# Altium project LUNA.PrjPcb
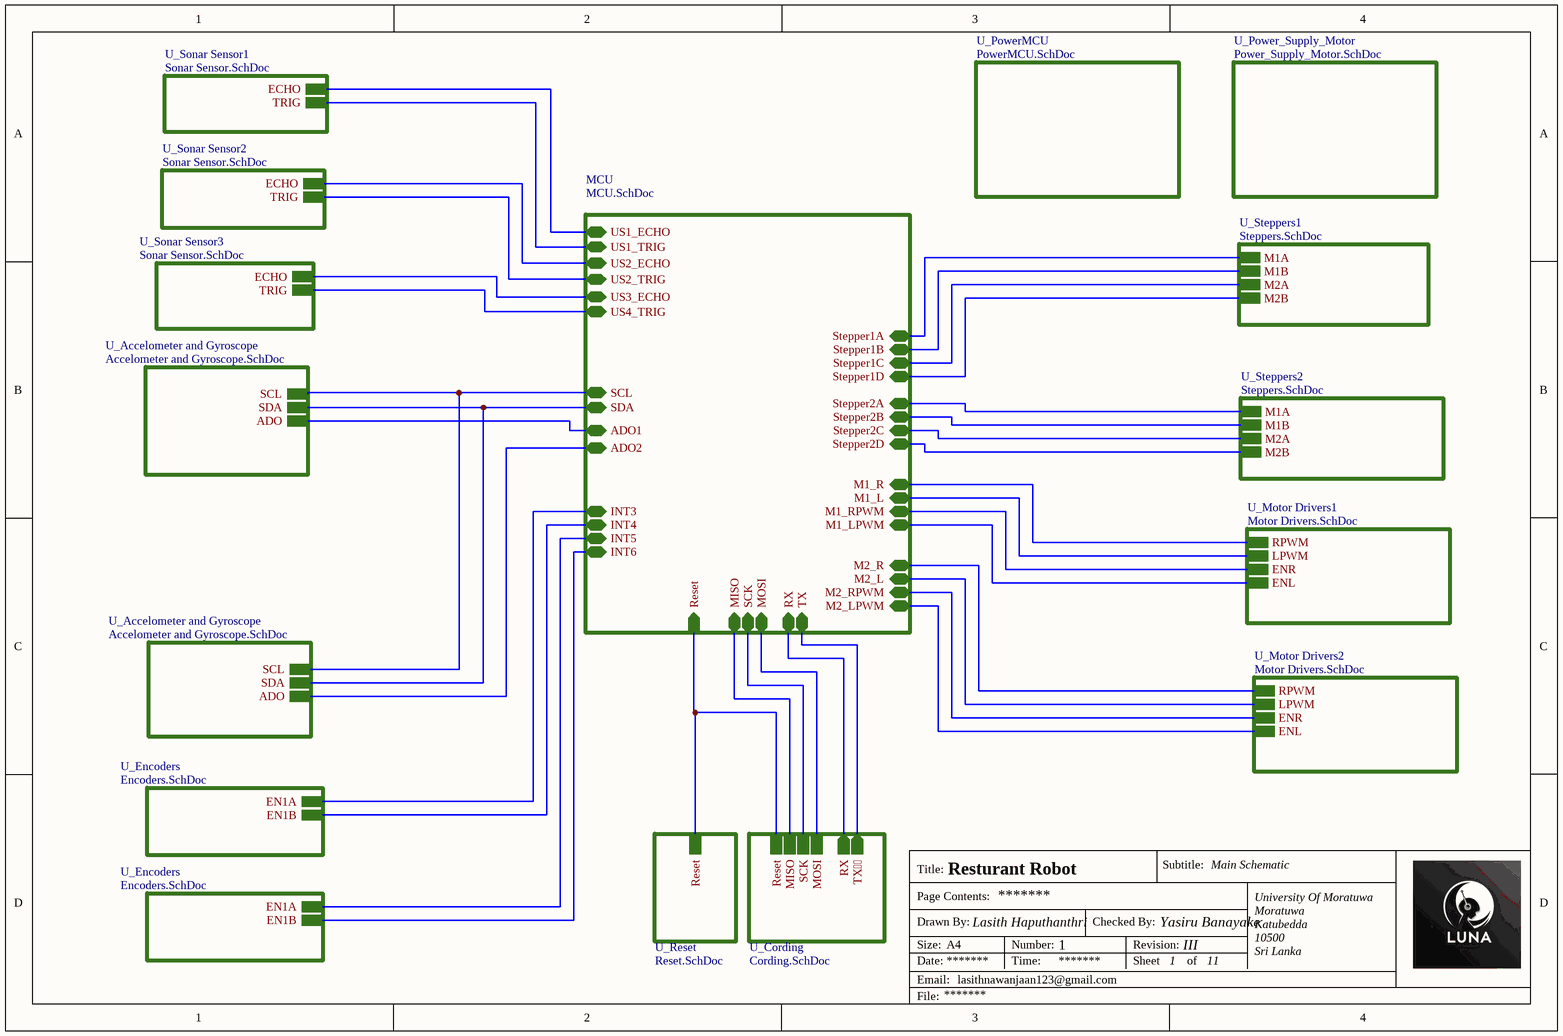
[diagram p0: Main_Schematic.SchDoc]
11 sheets, 53 parts. Net scope: hierarchical (ports join the sheet entries above them; power ports are global).
Board file: PCB.PcbDoc
Sheets:
  Main_Schematic.SchDoc
    MCU = MCU.SchDoc
    U_Reset = Reset.SchDoc
    U_Accelometer and Gyroscope = Accelometer and Gyroscope.SchDoc
    U_Accelometer and Gyroscope = Accelometer and Gyroscope.SchDoc
    U_Encoders = Encoders.SchDoc
    U_Steppers1 = Steppers.SchDoc
    U_Steppers2 = Steppers.SchDoc
    U_Motor Drivers1 = Motor Drivers.SchDoc
    U_Motor Drivers2 = Motor Drivers.SchDoc
    U_Encoders = Encoders.SchDoc
    U_Cording = Cording.SchDoc
    U_Sonar Sensor1 = Sonar Sensor.SchDoc
    U_Sonar Sensor2 = Sonar Sensor.SchDoc
    U_Sonar Sensor3 = Sonar Sensor.SchDoc
    U_PowerMCU = PowerMCU.SchDoc
    U_Power_Supply_Motor = Power_Supply_Motor.SchDoc

## Sheet Main_Schematic.SchDoc: Title
size A4; Date: *******; ApprovedBy: *******; CheckedBy: Yasiru Banayake; Author: *******; CompanyName: *******; DrawnBy: Lasith Haputhanthri; Engineer: *******; Organization: *******; Address1: *******; Address2: *******; Address3: *******; Address4: *******; DocumentNumber: 1; Revision: *******; SheetNumber: 1; SheetTotal: 11; Subtitle: Main Schematic; Project: Resturant Robot; VersionRevision: III; TotalSheet: 11; CurrentTime: *******; CurrentDate: *******; Time: *******; DocumentFullPathAndName: *******; DocumentName: *******; ModifiedDate: *******; ImagePath: *******; ProjectName: *******; Application_BuildNumber: *******

### Sub-sheets
MCU = MCU.SchDoc: Reset (in), INT3 (bidir), INT4 (bidir), INT5 (bidir), INT6 (bidir), SCL (bidir), SDA (bidir), M1_RPWM (bidir), M1_LPWM (bidir), M2_RPWM (bidir), M2_LPWM (bidir), ADO1 (bidir), ADO2 (bidir), M1_R (bidir), M1_L (bidir), M2_R (bidir), M2_L (bidir), Stepper1A (bidir), Stepper1B (bidir), Stepper1C (bidir), Stepper1D (bidir), Stepper2C (bidir), Stepper2A (bidir), Stepper2B (bidir), Stepper2D (bidir), TX (bidir), RX (bidir), SCK (bidir), MOSI (bidir), MISO (bidir), US1_ECHO (bidir), US1_TRIG (bidir), US2_ECHO (bidir), US2_TRIG (bidir), US3_ECHO (bidir), US4_TRIG (bidir)
U_Accelometer and Gyroscope = Accelometer and Gyroscope.SchDoc: SCL, SDA, ADO
U_Accelometer and Gyroscope = Accelometer and Gyroscope.SchDoc: SCL, SDA, ADO
U_Cording = Cording.SchDoc: MOSI, Reset, SCK, MISO, RX (out), TX (out)
U_Encoders = Encoders.SchDoc: EN1A, EN1B
U_Encoders = Encoders.SchDoc: EN1A, EN1B
U_Motor Drivers1 = Motor Drivers.SchDoc: RPWM, LPWM, ENR, ENL
U_Motor Drivers2 = Motor Drivers.SchDoc: RPWM, LPWM, ENR, ENL
U_Power_Supply_Motor = Power_Supply_Motor.SchDoc: no entries
U_PowerMCU = PowerMCU.SchDoc: no entries
U_Reset = Reset.SchDoc: Reset
U_Sonar Sensor1 = Sonar Sensor.SchDoc: ECHO, TRIG
U_Sonar Sensor2 = Sonar Sensor.SchDoc: ECHO, TRIG
U_Sonar Sensor3 = Sonar Sensor.SchDoc: ECHO, TRIG
U_Steppers1 = Steppers.SchDoc: M1A, M1B, M2A, M2B
U_Steppers2 = Steppers.SchDoc: M1A, M1B, M2A, M2B

### Nets
0P: sheet MCU/TX, sheet U_Cording/TX
1P: sheet MCU/RX, sheet U_Cording/RX
2P: sheet MCU/INT3, sheet U_Encoders/EN1A
3P: sheet MCU/INT4, sheet U_Encoders/EN1B
4P: sheet MCU/Stepper2D, sheet U_Steppers2/M2B
6P: sheet MCU/M1_RPWM, sheet U_Motor Drivers1/ENR
7P: sheet MCU/M1_LPWM, sheet U_Motor Drivers1/ENL
8P: sheet MCU/M2_RPWM, sheet U_Motor Drivers2/ENR
9P: sheet MCU/M2_LPWM, sheet U_Motor Drivers2/ENL
10P: sheet MCU/Stepper1A, sheet U_Steppers1/M1A
11P: sheet MCU/Stepper1B, sheet U_Steppers1/M1B
12P: sheet MCU/Stepper1C, sheet U_Steppers1/M2A
13P: sheet MCU/Stepper1D, sheet U_Steppers1/M2B
18P: sheet MCU/INT6, sheet U_Encoders/EN1B
19P: sheet MCU/INT5, sheet U_Encoders/EN1A
20P: sheet MCU/SDA, sheet U_Accelometer and Gyroscope/SDA, sheet U_Accelometer and Gyroscope/SDA
21P: sheet MCU/SCL, sheet U_Accelometer and Gyroscope/SCL, sheet U_Accelometer and Gyroscope/SCL
22P: sheet MCU/ADO1, sheet U_Accelometer and Gyroscope/ADO
23P: sheet MCU/ADO2, sheet U_Accelometer and Gyroscope/ADO
24P: sheet MCU/M1_R, sheet U_Motor Drivers1/RPWM
25P: sheet MCU/M1_L, sheet U_Motor Drivers1/LPWM
26P: sheet MCU/M2_R, sheet U_Motor Drivers2/RPWM
44P: sheet MCU/Stepper2C, sheet U_Steppers2/M2A
45P: sheet MCU/Stepper2B, sheet U_Steppers2/M1B
46P: sheet MCU/Stepper2A, sheet U_Steppers2/M1A
50P: sheet MCU/MISO, sheet U_Cording/MISO
51P: sheet MCU/MOSI, sheet U_Cording/MOSI
52P: sheet MCU/SCK, sheet U_Cording/SCK
A0: sheet MCU/US1_ECHO, sheet U_Sonar Sensor1/ECHO
A1: sheet MCU/US1_TRIG, sheet U_Sonar Sensor1/TRIG
A2: sheet MCU/US2_ECHO, sheet U_Sonar Sensor2/ECHO
A3: sheet MCU/US2_TRIG, sheet U_Sonar Sensor2/TRIG
A4: sheet MCU/US3_ECHO, sheet U_Sonar Sensor3/ECHO
A5: sheet MCU/US4_TRIG, sheet U_Sonar Sensor3/TRIG
LPWM: sheet MCU/M2_L, sheet U_Motor Drivers2/LPWM
Reset: sheet MCU/Reset, sheet U_Reset/Reset, sheet U_Cording/Reset

### Notes on the sheet
- Title:
- Drawn By:
- Page Contents:
- Checked By:
- Subtitle:
- University Of Moratuwa
- Moratuwa
- Size:
- Date:
- File:
- Email:
- A4
- lasithnawanjaan123@gmail.com
- Lasith Haputhanthri
- Number:
- Time:
- Revision:
- Sheet
- of
- Katubedda
- 10500
- Sri Lanka

## Sheet MCU.SchDoc: Title
size A4; Date: *******; ApprovedBy: *******; CheckedBy: Yasiru Banayake; Author: *******; CompanyName: *******; DrawnBy: Name; Engineer: *******; Organization: *******; Address1: *******; Address2: *******; Address3: *******; Address4: *******; DocumentNumber: Doc Num; Revision: *******; SheetNumber: 11; SheetTotal: 11; Subtitle: MCU; Project: Resturant Robot; VersionRevision: III; TotalSheet: 11; CurrentTime: *******; CurrentDate: *******; Time: *******; DocumentFullPathAndName: *******; DocumentName: *******; ModifiedDate: *******; ImagePath: *******; ProjectName: *******; Application_BuildNumber: *******
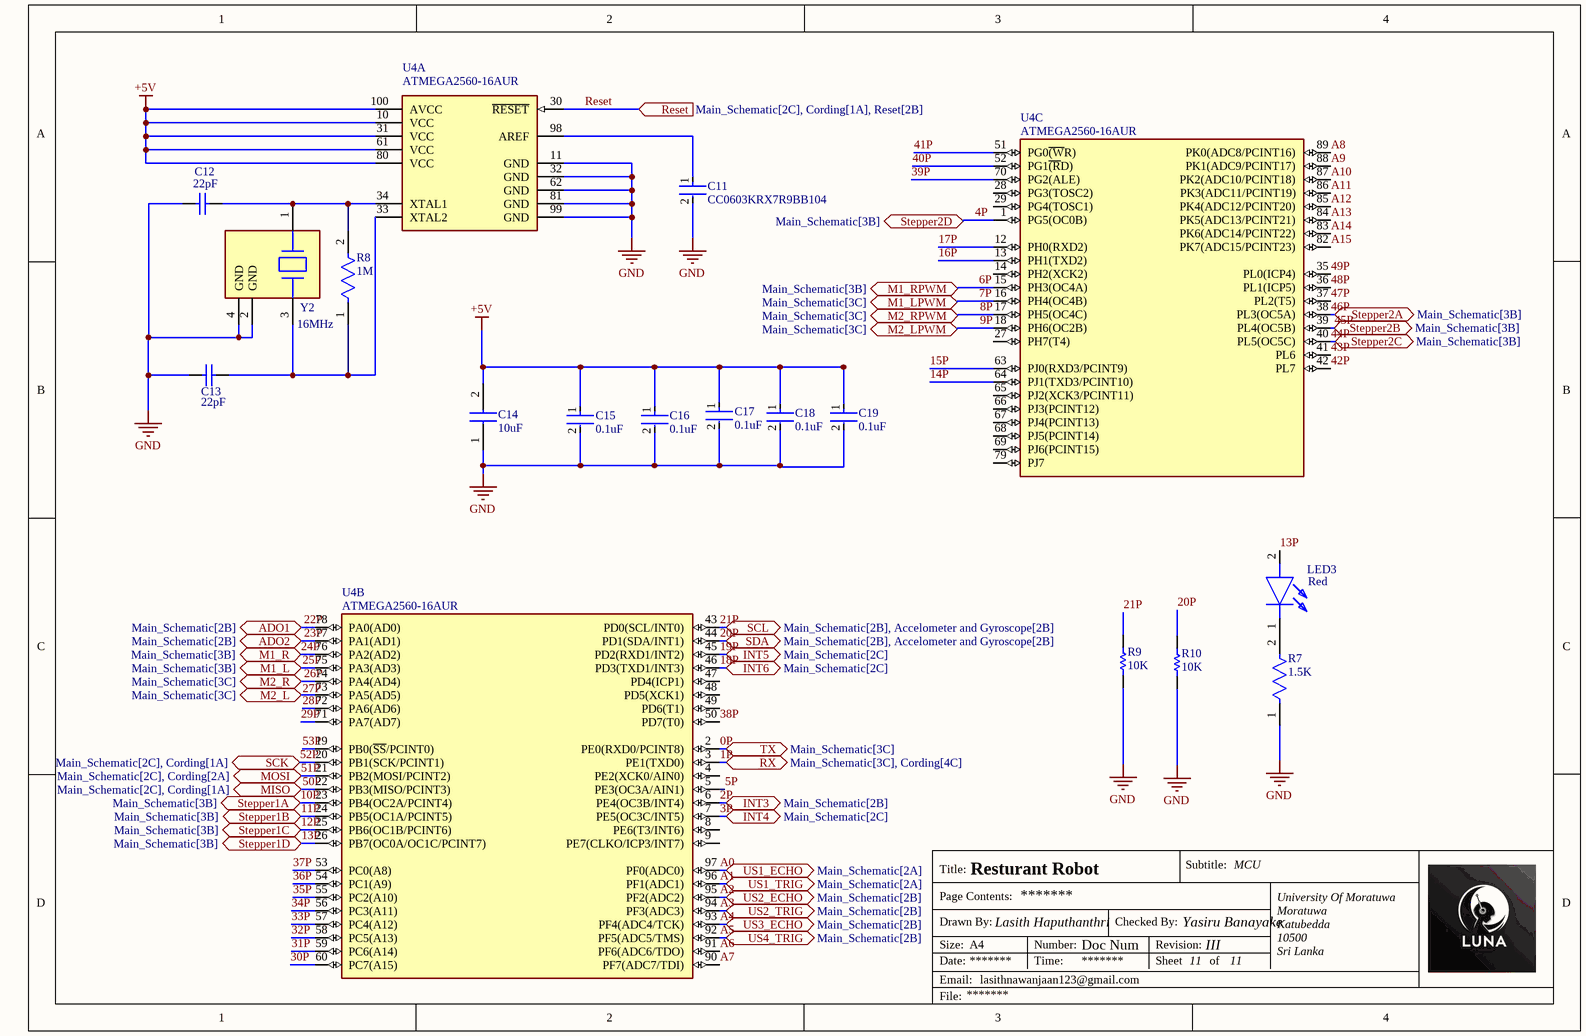
[diagram p1: MCU.SchDoc]

### Parts
C11  CC0603KRX7R9BB104  [FP-CC0603-DA-MFG]
C12  22pF  [CAPC1608X90X40LL10T20]
C13  22pF  [CAPC1608X90X40LL10T20]
C14  10uF  [CAPC1608X90N]
C15  0.1uF  [FP-CC0603-DA-MFG]
C16  0.1uF  [FP-CC0603-DA-MFG]
C17  0.1uF  [FP-CC0603-DA-MFG]
C18  0.1uF  [FP-CC0603-DA-MFG]
C19  0.1uF  [FP-CC0603-DA-MFG]
LED3  Red  [LEDC1608X55N]
R7  1.5K  [FP-AF0603-IPC_B]
R8  1M  [FP-AF0603-IPC_B]
R9  10K  [RESC1608X55X25ML10T15]
R10  10K  [RESC1608X55X25ML10T15]
U4  ATMEGA2560-16AUR  [FP-100A-MFG]  (parts A,B,C of 3)
Y2  16MHz  [FP-ABM8G-MFG]

### Ports
ADO1 (bidir, see Main_Schematic[2B]), ADO2 (bidir, see Main_Schematic[2B]), INT3 (bidir, see Main_Schematic[2B]), INT4 (bidir, see Main_Schematic[2C]), INT5 (bidir, see Main_Schematic[2C]), INT6 (bidir, see Main_Schematic[2C]), M1_L (bidir, see Main_Schematic[3B]), M1_LPWM (bidir, see Main_Schematic[3C]), M1_R (bidir, see Main_Schematic[3B]), M1_RPWM (bidir, see Main_Schematic[3B]), M2_L (bidir, see Main_Schematic[3C]), M2_LPWM (bidir, see Main_Schematic[3C]), M2_R (bidir, see Main_Schematic[3C]), M2_RPWM (bidir, see Main_Schematic[3C]), MISO (bidir, see Main_Schematic[2C], Cording[1A]), MOSI (bidir, see Main_Schematic[2C], Cording[2A]), Reset (in, see Main_Schematic[2C], Cording[1A], Reset[2B]), RX (bidir, see Main_Schematic[3C], Cording[4C]), SCK (bidir, see Main_Schematic[2C], Cording[1A]), SCL (bidir, see Main_Schematic[2B], Accelometer and Gyroscope[2B]), SDA (bidir, see Main_Schematic[2B], Accelometer and Gyroscope[2B]), Stepper1A (bidir, see Main_Schematic[3B]), Stepper1B (bidir, see Main_Schematic[3B]), Stepper1C (bidir, see Main_Schematic[3B]), Stepper1D (bidir, see Main_Schematic[3B]), Stepper2A (bidir, see Main_Schematic[3B]), Stepper2B (bidir, see Main_Schematic[3B]), Stepper2C (bidir, see Main_Schematic[3B]), Stepper2D (bidir, see Main_Schematic[3B]), TX (bidir, see Main_Schematic[3C]), US1_ECHO (bidir, see Main_Schematic[2A]), US1_TRIG (bidir, see Main_Schematic[2A]), US2_ECHO (bidir, see Main_Schematic[2B]), US2_TRIG (bidir, see Main_Schematic[2B]), US3_ECHO (bidir, see Main_Schematic[2B]), US4_TRIG (bidir, see Main_Schematic[2B])

### Nets
+5V: C14.2 C15.1 C16.1 C17.1 C18.1 C19.1 U4.10(VCC) U4.31(VCC) U4.61(VCC) U4.80(VCC) U4.100(AVCC)
GND: C11.2 C12.1 C13.1 C14.1 C15.2 C16.2 C17.2 C18.2 C19.2 R7.1 R9.1 R10.1 U4.11(GND) U4.32(GND) U4.62(GND) U4.81(GND) U4.99(GND) Y2.2(GND) Y2.4(GND)
0P: U4.2(PE0(RXD0/PCINT8)) ; port TX
1P: U4.3(PE1(TXD0)) ; port RX
2P: U4.6(PE4(OC3B/INT4)) ; port INT3
3P: U4.7(PE5(OC3C/INT5)) ; port INT4
4P: U4.1(PG5(OC0B)) ; port Stepper2D
5P: U4.5(PE3(OC3A/AIN1))
6P: U4.15(PH3(OC4A)) ; port M1_RPWM
7P: U4.16(PH4(OC4B)) ; port M1_LPWM
8P: U4.17(PH5(OC4C)) ; port M2_RPWM
9P: U4.18(PH6(OC2B)) ; port M2_LPWM
10P: U4.23(PB4(OC2A/PCINT4)) ; port Stepper1A
11P: U4.24(PB5(OC1A/PCINT5)) ; port Stepper1B
12P: U4.25(PB6(OC1B/PCINT6)) ; port Stepper1C
13P: LED3.2(A) U4.26(PB7(OC0A/OC1C/PCINT7)) ; port Stepper1D
14P: U4.64(PJ1(TXD3/PCINT10))
15P: U4.63(PJ0(RXD3/PCINT9))
16P: U4.13(PH1(TXD2))
17P: U4.12(PH0(RXD2))
18P: U4.46(PD3(TXD1/INT3)) ; port INT6
19P: U4.45(PD2(RXD1/INT2)) ; port INT5
20P: R10.2 U4.44(PD1(SDA/INT1)) ; port SDA
21P: R9.2 U4.43(PD0(SCL/INT0)) ; port SCL
22P: U4.78(PA0(AD0)) ; port ADO1
23P: U4.77(PA1(AD1)) ; port ADO2
24P: U4.76(PA2(AD2)) ; port M1_R
25P: U4.75(PA3(AD3)) ; port M1_L
26P: U4.74(PA4(AD4)) ; port M2_R
28P: U4.72(PA6(AD6))
29P: U4.71(PA7(AD7))
30P: U4.60(PC7(A15))
31P: U4.59(PC6(A14))
32P: U4.58(PC5(A13))
33P: U4.57(PC4(A12))
34P: U4.56(PC3(A11))
35P: U4.55(PC2(A10))
36P: U4.54(PC1(A9))
37P: U4.53(PC0(A8))
38P: U4.50(PD7(T0))
39P: U4.70(PG2(ALE))
40P: U4.52(PG1~{(R}D))
41P: U4.51(PG0~{(W}R))
42P: U4.42(PL7)
43P: U4.41(PL6)
44P: U4.40(PL5(OC5C)) ; port Stepper2C
45P: U4.39(PL4(OC5B)) ; port Stepper2B
46P: U4.38(PL3(OC5A)) ; port Stepper2A
47P: U4.37(PL2(T5))
48P: U4.36(PL1(ICP5))
49P: U4.35(PL0(ICP4))
50P: U4.22(PB3(MISO/PCINT3)) ; port MISO
51P: U4.21(PB2(MOSI/PCINT2)) ; port MOSI
52P: U4.20(PB1(SCK/PCINT1)) ; port SCK
53P: U4.19(PB0(~{SS}/PCINT0))
A0: U4.97(PF0(ADC0)) ; port US1_ECHO
A1: U4.96(PF1(ADC1)) ; port US1_TRIG
A2: U4.95(PF2(ADC2)) ; port US2_ECHO
A3: U4.94(PF3(ADC3)) ; port US2_TRIG
A4: U4.93(PF4(ADC4/TCK)) ; port US3_ECHO
A5: U4.92(PF5(ADC5/TMS)) ; port US4_TRIG
A6: U4.91(PF6(ADC6/TDO))
A7: U4.90(PF7(ADC7/TDI))
A8: U4.89(PK0(ADC8/PCINT16))
A9: U4.88(PK1(ADC9/PCINT17))
A10: U4.87(PK2(ADC10/PCINT18))
A11: U4.86(PK3(ADC11/PCINT19))
A12: U4.85(PK4(ADC12/PCINT20))
A13: U4.84(PK5(ADC13/PCINT21))
A14: U4.83(PK6(ADC14/PCINT22))
A15: U4.82(PK7(ADC15/PCINT23))
LPWM: U4.73(PA5(AD5)) ; port M2_L
Reset: U4.30(~{RESET}) ; port Reset
NetC11_1: C11.1 U4.98(AREF)
NetC12_2: C12.2 R8.2 U4.34(XTAL1) Y2.1
NetC13_2: C13.2 R8.1 U4.33(XTAL2) Y2.3
NetLED3_1: LED3.1(K) R7.2

Not connected (* = marked no-connect by the designer): U4 4(PE2(XCK0/AIN0)) 8(PE6(T3/INT6)) 9(PE7(CLKO/ICP3/INT7)) 14(PH2(XCK2)) 27(PH7(T4)) 28(PG3(TOSC2)) 29(PG4(TOSC1)) 47(PD4(ICP1)) 48(PD5(XCK1)) 49(PD6(T1)) 65(PJ2(XCK3/PCINT11)) 66(PJ3(PCINT12)) 67(PJ4(PCINT13)) 68(PJ5(PCINT14)) 69(PJ6(PCINT15)) 79(PJ7)

### Notes on the sheet
- Labels drawn without touching a wire or pin: 27P
- Title:
- Drawn By:
- Page Contents:
- Checked By:
- Subtitle:
- University Of Moratuwa
- Moratuwa
- Size:
- Date:
- File:
- Email:
- A4
- lasithnawanjaan123@gmail.com
- Lasith Haputhanthri
- Number:
- Time:
- Revision:
- Sheet
- of
- Katubedda
- 10500
- Sri Lanka

### Library data of the parts
C11 = CMP-2100-03601-2: CAP CER 0.1UF 50V X7R 0603; Manufacturer: YAGEO; Material: Ceramic; Capacitance: 100 nF; Temperature Coefficient: 15%; Tolerance: 0.1; Value: 100 nF; Height: 0.9mm; Voltage: 50 V; ComponentLink2Description: Datasheet; Device Class L2: Capacitors; Temperature Range High: +125°C; Category: Cap; Footprint Url: http://www.yageo.com/exep/pages/download/literatures/UPY-C_GEN_24.pdf; ComponentLink2URL: http://www.yageo.com/documents/recent/UPY-GPHC_X7R_6.3V-to-50V_18.pdf; Package: CC0603-DA; Temperature: -55°C to +125°C; Voltage Rating: 50 V; Temperature Characteristic: X7R; Device Class L1: Passive Components; Temperature Range Low: -55°C; Manufacturer Part Number: CC0603KRX7R9BB104; RoHS: TRUE; Automotive: No; Device Class L3: Ceramic Capacitors; Octopart: https://octopart.com/cc0603krx7r9bb104-yageo-42244635; Mouser Description: Multilayer Ceramic Capacitor, CC Series, 0.1 - F, - 10%, X7R, 50 V, 0603 [1608 Metric]; Lead Free: Yes; Digikey Description: CAP CER 0.1UF 50V X7R 0603
C12 C13 = CMP-1659-00026-1: CC0603JRNPO9BN220 Chip Capacitor, 22 pF, +/- 5%, 50 V, -55 to 125 degC, 0603 (1608 Metric), RoHS, Tape and Reel; ComponentLink1URL: http://www.yageo.com/; PackageReference: 0603; ComponentLink1Description: Manufacturer URL; PackageDescription: 2-Pin Surface Mount Device, Body 1.6 x 0.8 mm; DatasheetVersion: Rev. 8, 08/2011; ComponentLink2Description: Datasheet; ComponentLink2URL: http://www.yageo.com/documents/recent/UPY-GP_NP0_16V-to-50V_8.pdf
C14 = CL10A106KP8NNNC: CL10A106KP8NNNC Capacitor; Manufacturer_Name: SAMSUNG; Datasheet Link: https://datasheet.datasheetarchive.com/originals/distributors/Datasheets-DGA10/2415998.pdf; Height: 0.9mm; Manufacturer_Part_Number: CL10A106KP8NNNC; Mouser Part Number: 187-CL10A106KP8NNNC; Mouser Price/Stock: https://www.mouser.co.uk/ProductDetail/Samsung-Electro-Mechanics/CL10A106KP8NNNC?qs=X6jEic%2FHinAlyfRHj7fKwg%3D%3D; Arrow Part Number: CL10A106KP8NNNC; Arrow Price/Stock: https://www.arrow.com/en/products/cl10a106kp8nnnc/samsung-electro-mechanics?region=europe
C15-C19 = CMP-2100-03601-2: CC0603KRX7R9BB104 CAP CER 0.1UF 50V X7R 0603; Manufacturer: YAGEO; Material: Ceramic; Capacitance: 100 nF; Temperature Coefficient: 15%; Tolerance: 0.1; Value: 100 nF; Height: 0.9mm; Voltage: 50 V; ComponentLink2Description: Datasheet; Device Class L2: Capacitors; Temperature Range High: +125°C; Category: Cap; Footprint Url: http://www.yageo.com/exep/pages/download/literatures/UPY-C_GEN_24.pdf; ComponentLink2URL: http://www.yageo.com/documents/recent/UPY-GPHC_X7R_6.3V-to-50V_18.pdf; Package: CC0603-DA; Temperature: -55°C to +125°C; Voltage Rating: 50 V; Temperature Characteristic: X7R; Device Class L1: Passive Components; Temperature Range Low: -55°C; Manufacturer Part Number: CC0603KRX7R9BB104; RoHS: TRUE; Automotive: No; Device Class L3: Ceramic Capacitors; Octopart: https://octopart.com/cc0603krx7r9bb104-yageo-42244635; Mouser Description: Multilayer Ceramic Capacitor, CC Series, 0.1 - F, - 10%, X7R, 50 V, 0603 [1608 Metric]; Lead Free: Yes; Digikey Description: CAP CER 0.1UF 50V X7R 0603
LED3 = LTST-C191KRKT: LED; Manufacturer_Name: Lite-On; Datasheet Link: http://www.mouser.com/ds/2/239/S_110_LTST-C191KRKT-539838.pdf; Height: 0.55mm; Manufacturer_Part_Number: LTST-C191KRKT; Mouser Part Number: 859-LTST-C191KRKT; Mouser Price/Stock: https://www.mouser.co.uk/ProductDetail/Lite-On/LTST-C191KRKT?qs=BAIUz4Y8PJBLfOhzue0q%252BA%3D%3D; Arrow Part Number: LTST-C191KRKT; Arrow Price/Stock: https://www.arrow.com/en/products/ltst-c191krkt/lite-on-technology?region=nac
R7 R8 = CMP-03412-043191-1: AF0603FR-071K5L Anti-Sulfurated Chip Resistors Automotive Grade 1.5kΩ 1% 100ppm/°C 0603; Resistance: 1.5kR; Max Power Dissipation: 100mW; Length: 0.063inch; Packaging: Tape and Reel; Tolerance: 1%; RoHS Compliant: Yes; Series: AF; Temperature Coefficient: 100ppm/°C; Case/Package: 0603; Height: 0.022inch; Min Operating Temperature: -55°C; Resistor Type: Thick Film; Features: Moisture Resistant; Width: 0.031inch; Number of Terminations: 2; Max Operating Temperature: 155°C
R9 R10 = CMP-2000-05022-1: RC0603JR-0710KL Resistor, 10 KOhm, +/- 5%, 100 mW, -55 to 155 degC, 0603 (1608 Metric), RoHS, Tape and Reel; Manufacturer: Yageo; Resistance: 10kOhms; Voltage Rating: 50V; Temperature Coefficient: 100PPM/C; Power Rating: 100mW; Package Reference: 603; Series: RC; Case Code - mm: 1608; Packaging: Reel; Datasheet URL: http://www.farnell.com/datasheets/443971.pdf; Datasheet Version: Rev. 4, 04/2009; Operating Temperature Range: -55Cto+155C; Product: ThickFilmResistorsGeneralPurpose; Package Description: 2-Pin Surface Mount Device, Body 1.6 x 0.8 mm; Manufacturer URL: http://www.yageo.com/; Case Code - in: 0603; Tolerance: 5%; Termination Style: SMD/SMT
U4 = CMP-06276-000073-1: IC MCU 8BIT 256KB FLASH 100TQFP; Oscillator Type: External; Interface: UART; Memory Type: OTP; Memory Size: 8KB; Core Architecture: PIC; Peripherals: POR; Frequency: 16MHz; Number of I/Os: 33; Packaging: Rail/Tube; Max Operating Temperature: 70°C; Case/Package: DIP; Min Operating Temperature: 0°C
Y2 = CMP-2000-05039-3: ABM8G-16.000MHZ-18-D2Y-T Crystal 12MHz ±20ppm (Tol) ±30ppm (Stability) 18pF FUND 120Ω 4-Pin SMD T/R; Series Resistance: 120R; Max Operating Temperature: 85°C; Mount: Surface Mount; Width: 2.5mm; Series: ABM8G; Termination: SMD/SMT; Frequency Tolerance: 20ppm; Tolerance: 20ppm; Min Operating Temperature: -40°C; Operating Frequency: 12 MHz; Depth: 2.5mm; Load Capacitance: 18pF; Number of Pins: 4; Length: 3.2mm; Radiation Hardening: No; Frequency Stability: 30ppm; Height: 1mm; Packaging: Tape and Reel; Package Quantity: 1000; ESR (Equivalent Series Resistance): 120R; Lead Free: Lead Free; Frequency: 12MHz; Case/Package: CSMD

## Sheet Reset.SchDoc: Title
size A4; Date: *******; ApprovedBy: *******; CheckedBy: Yasiru Banayake; Author: *******; CompanyName: *******; DrawnBy: Name; Engineer: *******; Organization: *******; Address1: *******; Address2: *******; Address3: *******; Address4: *******; DocumentNumber: Doc Num; Revision: *******; SheetNumber: 9; SheetTotal: 11; Subtitle: MCU Reset; Project: Resturant Robot; VersionRevision: III; TotalSheet: 11; CurrentTime: *******; CurrentDate: *******; Time: *******; DocumentFullPathAndName: *******; DocumentName: *******; ModifiedDate: *******; ImagePath: *******; ProjectName: *******; Application_BuildNumber: *******
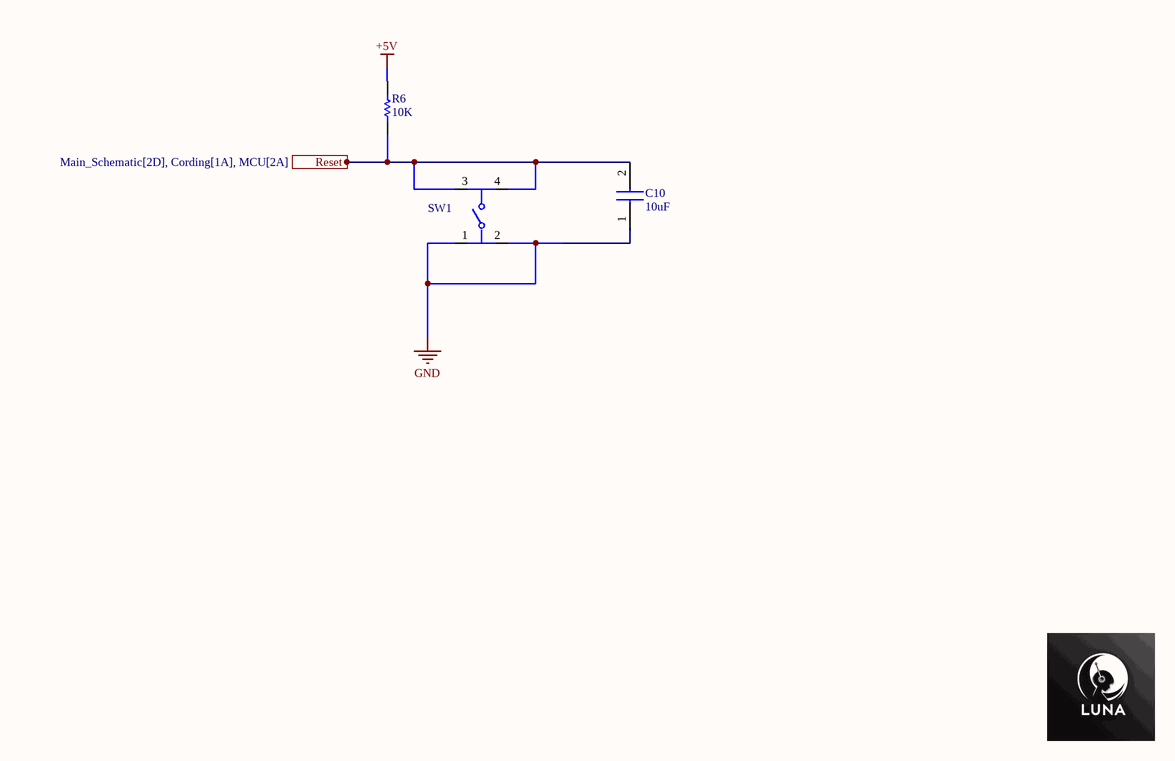
[diagram p2: Reset.SchDoc]

### Parts
C10  10uF  [CAPC1608X90N]
R6  10K  [RESC1608X55X25ML10T15]
SW1  PTS526SK15SMTR2LFS  [FP-PTS526SK15SMTR2LFS-MFG]  (value not drawn)

### Ports
Reset (see Main_Schematic[2D], Cording[1A], MCU[2A])

### Nets
+5V: R6.2
GND: C10.1 SW1.1 SW1.2
Reset: C10.2 R6.1 SW1.3 SW1.4 ; port Reset

### Notes on the sheet
- Title:
- Drawn By:
- Page Contents:
- Checked By:
- Subtitle:
- University Of Moratuwa
- Moratuwa
- Size:
- Date:
- File:
- Email:
- A4
- lasithnawanjaan123@gmail.com
- Lasith Haputhanthri
- Number:
- Time:
- Revision:
- Sheet
- of
- Katubedda
- 10500
- Sri Lanka

### Library data of the parts
C10 = CL10A106KP8NNNC: as C14 on sheet MCU; Datasheet Link: https://datasheet.datasheetarchive.com/originals/distributors/Datasheets-DGA10/2415998.pdf; Height: 0.9mm; Manufacturer_Part_Number: CL10A106KP8NNNC; Mouser Part Number: 187-CL10A106KP8NNNC; Mouser Price/Stock: https://www.mouser.co.uk/ProductDetail/Samsung-Electro-Mechanics/CL10A106KP8NNNC?qs=X6jEic%2FHinAlyfRHj7fKwg%3D%3D; Arrow Part Number: CL10A106KP8NNNC; Arrow Price/Stock: https://www.arrow.com/en/products/cl10a106kp8nnnc/samsung-electro-mechanics?region=europe
R6 = CMP-2000-05022-1: as R9 on sheet MCU; Package Reference: 603; Series: RC; Case Code - mm: 1608; Packaging: Reel; Datasheet URL: http://www.farnell.com/datasheets/443971.pdf; Datasheet Version: Rev. 4, 04/2009; Operating Temperature Range: -55Cto+155C; Product: ThickFilmResistorsGeneralPurpose; Package Description: 2-Pin Surface Mount Device, Body 1.6 x 0.8 mm; Manufacturer URL: http://www.yageo.com/; Case Code - in: 0603; Tolerance: 5%; Termination Style: SMD/SMT
SW1 = CMP-10040-000013-1: TACT 5.2 X 5.2, 1.5 MM H, 260GF,; Manufacturer: C&K; Operating Force: 250gf; Throw Configuration: SPST-NO; Contact Current Rating: 50mA; Standoff Height: 0mm; Contact Resistance: 100mΩ; Voltage Rating Dc: 12V; Electromechanical Life: 200000Cycles; Device Class L3: Tactile Switches; Device Class L2: Switches; Temperature: -20°C to +70°C; Temperature Range Low: -20°C; Package: PTS526SK15SMTR2LFS; Temperature Range High: +70°C; ComponentLink2Description: Datasheet; Device Class L1: Electromechanical; Height: 1.65mm; Digikey Description: TACT 5.2 X 5.2, 1.5 MM H, 260GF,; Category: Switch; RoHS: TRUE; Automotive: No; Lead Free: Yes; Manufacturer Part Number: PTS526SK15SMTR2LFS; Octopart: https://octopart.com/pts526+sk15+smtr2+lfs-c%26k+components-100617999; ComponentLink2URL: https://www.ckswitches.com/media/2780/pts526.pdf

## Sheet Accelometer and Gyroscope.SchDoc: Title
size A4; Date: *******; ApprovedBy: *******; CheckedBy: Yasiru Banayake; Author: *******; CompanyName: *******; DrawnBy: Name; Engineer: *******; Organization: *******; Address1: *******; Address2: *******; Address3: *******; Address4: *******; DocumentNumber: Doc Num; Revision: *******; SheetNumber: 2; SheetTotal: 11; Subtitle: Accelometer JST; Project: Resturant Robot; VersionRevision: III; TotalSheet: 11; CurrentTime: *******; CurrentDate: *******; Time: *******; DocumentFullPathAndName: *******; DocumentName: *******; ModifiedDate: *******; ImagePath: *******; ProjectName: *******; Application_BuildNumber: *******
Used 2 times, as channels U_Accelometer and Gyroscope, U_Accelometer and Gyroscope. Parts and nets are listed once, with the designators drawn on the sheet.
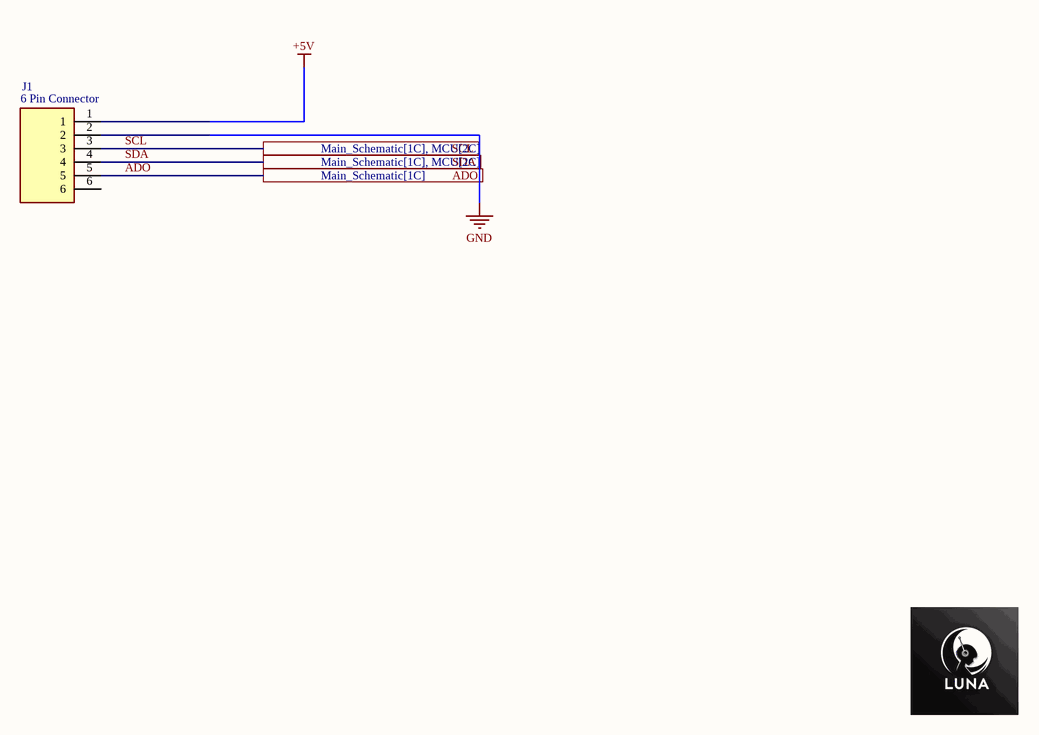
[diagram p3: Accelometer and Gyroscope.SchDoc]

### Parts
J1  6 Pin Connector  [SHDR6W64P0X250_1X6_1740X575X700P]

### Ports
ADO (see Main_Schematic[1C]), SCL (see Main_Schematic[1C], MCU[2C]), SDA (see Main_Schematic[1C], MCU[2C])

### Nets
+5V: J1.1
GND: J1.2
ADO: J1.5 ; port ADO
SCL: J1.3 ; port SCL
SDA: J1.4 ; port SDA

Not connected (* = marked no-connect by the designer): J1 6

### Channels
U_Accelometer and Gyroscope: designators end in _U_Accelometer_and_Gyroscope#1; ports ADO=22P SCL=21P SDA=20P
U_Accelometer and Gyroscope: designators end in _U_Accelometer_and_Gyroscope#2; ports ADO=23P SCL=21P SDA=20P

### Notes on the sheet
- Title:
- Drawn By:
- Page Contents:
- Checked By:
- Subtitle:
- University Of Moratuwa
- Moratuwa
- Size:
- Date:
- File:
- Email:
- A4
- lasithnawanjaan123@gmail.com
- Lasith Haputhanthri
- Number:
- Time:
- Revision:
- Sheet
- of
- Katubedda
- 10500
- Sri Lanka

### Library data of the parts
J1 = B6B-XH-A_LF__SN_: B6B-XH-A_LF__SN_ Connector; Manufacturer_Name: JST (JAPAN SOLDERLESS TERMINALS); Manufacturer_Part_Number: B6B-XH-A(LF)(SN); Datasheet Link: https://datasheet.lcsc.com/szlcsc/JST-Sales-America-B6B-XH-A-LF-SN_C144397.pdf; Height: 7mm; Arrow Part Number: B6B-XH-A(LF)(SN); Arrow Price/Stock: https://www.arrow.com/en/products/b6b-xh-a-lf-sn/jst-manufacturing?region=europe

## Sheet Encoders.SchDoc: Title
size A4; Date: *******; ApprovedBy: *******; CheckedBy: Yasiru Banayake; Author: *******; CompanyName: *******; DrawnBy: Name; Engineer: *******; Organization: *******; Address1: *******; Address2: *******; Address3: *******; Address4: *******; DocumentNumber: Doc Num; Revision: *******; SheetNumber: 4; SheetTotal: 11; Subtitle: Encoder JST; Project: Resturant Robot; VersionRevision: III; TotalSheet: 11; CurrentTime: *******; CurrentDate: *******; Time: *******; DocumentFullPathAndName: *******; DocumentName: *******; ModifiedDate: *******; ImagePath: *******; ProjectName: *******; Application_BuildNumber: *******
Used 2 times, as channels U_Encoders, U_Encoders. Parts and nets are listed once, with the designators drawn on the sheet.
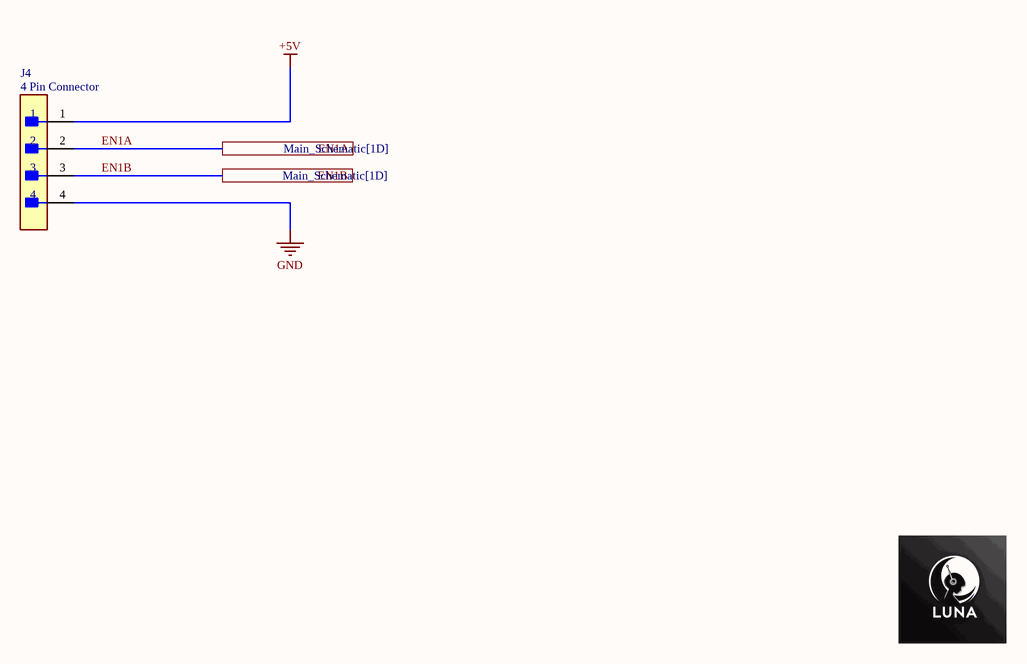
[diagram p4: Encoders.SchDoc]

### Parts
J4  4 Pin Connector  [FP-B4B-XH-A_LF_SN-MFG]

### Ports
EN1A (see Main_Schematic[1D]), EN1B (see Main_Schematic[1D])

### Nets
+5V: J4.1
GND: J4.4
EN1A: J4.2 ; port EN1A
EN1B: J4.3 ; port EN1B

### Channels
U_Encoders: designators end in _U_Encoders#1; ports EN1A=2P EN1B=3P
U_Encoders: designators end in _U_Encoders#2; ports EN1A=19P EN1B=18P

### Notes on the sheet
- Title:
- Drawn By:
- Page Contents:
- Checked By:
- Subtitle:
- University Of Moratuwa
- Moratuwa
- Size:
- Date:
- File:
- Email:
- A4
- lasithnawanjaan123@gmail.com
- Lasith Haputhanthri
- Number:
- Time:
- Revision:
- Sheet
- of
- Katubedda
- 10500
- Sri Lanka

### Library data of the parts
J4 = CMP-17439-000250-1: CONN HEADER VERT 4POS 2.5MM; Number of Contacts: 4; Contact Resistance: 20mR; Voltage Rating: 250V; Max Current Rating: 3A; Gender: Male; Wire/Cable Gauge: 22AWG; Mated Stacking Heights: 9.8mm; Insulation Resistance: 1GR; Orientation: Straight; Contact Type: Male Pin; Contact Finish - Mating: TIN; Series: XH; Max Voltage Rating (AC): 250V; Lead Pitch: 2.5mm; Contact Shape: Square; Insulation Color: Natural; Termination: Solder; Lead Free: Lead Free; Voltage Rating (AC): 250V; Number of Rows: 1; Flammability Rating: UL94 V-0; Number of Positions: 4; Max Operating Temperature: 85°C; Package Quantity: 500; Mount: Through Hole; REACH SVHC: No SVHC; Connector Type: Header; Insulation Material: Nylon; Fastening Type: Detent; Min Operating Temperature: -25°C; Housing Color: White; Packaging: Bulk; Contact Plating: Tin; Contact Material: Brass; Max Voltage Rating (DC): 250V; Housing Material: Polyamide; Color: Natural; Material: Polyamide; Pitch: 2.5mm; Depth: 5.75mm; Current Rating: 3A; Length: 12.4mm

## Sheet Steppers.SchDoc: Title
size A4; Date: *******; ApprovedBy: *******; CheckedBy: Yasiru Banayake; Author: *******; CompanyName: *******; DrawnBy: Name; Engineer: *******; Organization: *******; Address1: *******; Address2: *******; Address3: *******; Address4: *******; DocumentNumber: Doc Num; Revision: *******; SheetNumber: 10; SheetTotal: 11; Subtitle: Stepper Motor Driver JST; Project: Resturant Robot; VersionRevision: III; TotalSheet: 11; CurrentTime: *******; CurrentDate: *******; Time: *******; DocumentFullPathAndName: *******; DocumentName: *******; ModifiedDate: *******; ImagePath: *******; ProjectName: *******; Application_BuildNumber: *******
Used 2 times, as channels U_Steppers1, U_Steppers2. Parts and nets are listed once, with the designators drawn on the sheet.
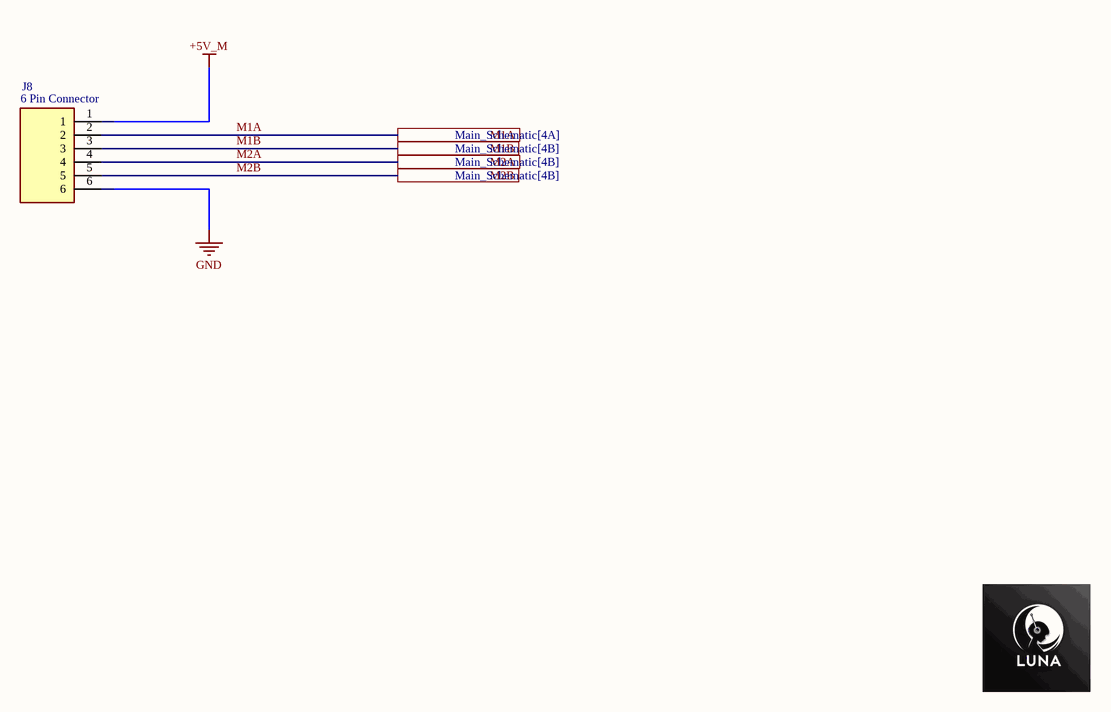
[diagram p5: Steppers.SchDoc]

### Parts
J8  6 Pin Connector  [SHDR6W64P0X250_1X6_1740X575X700P]

### Ports
M1A (see Main_Schematic[4A]), M1B (see Main_Schematic[4B]), M2A (see Main_Schematic[4B]), M2B (see Main_Schematic[4B])

### Nets
+5V_M: J8.1
GND: J8.6
M1A: J8.2 ; port M1A
M1B: J8.3 ; port M1B
M2A: J8.4 ; port M2A
M2B: J8.5 ; port M2B

### Channels
U_Steppers1: designators end in _U_Steppers1; ports M1A=10P M1B=11P M2A=12P M2B=13P
U_Steppers2: designators end in _U_Steppers2; ports M1A=46P M1B=45P M2A=44P M2B=4P

### Notes on the sheet
- Title:
- Drawn By:
- Page Contents:
- Checked By:
- Subtitle:
- University Of Moratuwa
- Moratuwa
- Size:
- Date:
- File:
- Email:
- A4
- lasithnawanjaan123@gmail.com
- Lasith Haputhanthri
- Number:
- Time:
- Revision:
- Sheet
- of
- Katubedda
- 10500
- Sri Lanka

### Library data of the parts
J8 = B6B-XH-A_LF__SN_: as J1 on sheet Accelometer and Gyroscope; Datasheet Link: https://datasheet.lcsc.com/szlcsc/JST-Sales-America-B6B-XH-A-LF-SN_C144397.pdf; Height: 7mm; Arrow Part Number: B6B-XH-A(LF)(SN); Arrow Price/Stock: https://www.arrow.com/en/products/b6b-xh-a-lf-sn/jst-manufacturing?region=europe

## Sheet Motor Drivers.SchDoc: Title
size A4; Date: *******; ApprovedBy: *******; CheckedBy: Yasiru Banayake; Author: *******; CompanyName: *******; DrawnBy: Name; Engineer: *******; Organization: *******; Address1: *******; Address2: *******; Address3: *******; Address4: *******; DocumentNumber: Doc Num; Revision: *******; SheetNumber: 5; SheetTotal: 11; Subtitle: Motor Drivers JST; Project: Resturant Robot; VersionRevision: III; TotalSheet: 11; CurrentTime: *******; CurrentDate: *******; Time: *******; DocumentFullPathAndName: *******; DocumentName: *******; ModifiedDate: *******; ImagePath: *******; ProjectName: *******; Application_BuildNumber: *******
Used 2 times, as channels U_Motor Drivers1, U_Motor Drivers2. Parts and nets are listed once, with the designators drawn on the sheet.
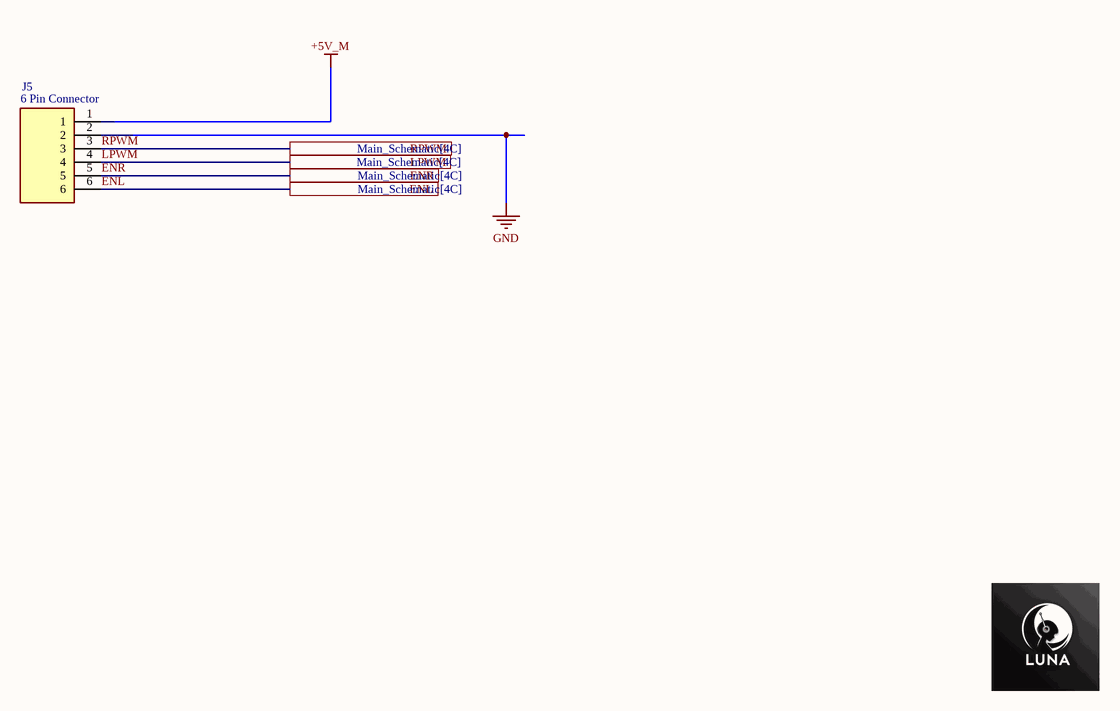
[diagram p6: Motor Drivers.SchDoc]

### Parts
J5  6 Pin Connector  [SHDR6W64P0X250_1X6_1740X575X700P]

### Ports
ENL (see Main_Schematic[4C]), ENR (see Main_Schematic[4C]), LPWM (see Main_Schematic[4C]), RPWM (see Main_Schematic[4C])

### Nets
+5V_M: J5.1
GND: J5.2
ENL: J5.6 ; port ENL
ENR: J5.5 ; port ENR
LPWM: J5.4 ; port LPWM
RPWM: J5.3 ; port RPWM

### Channels
U_Motor Drivers1: designators end in _U_Motor_Drivers1; ports ENL=7P ENR=6P LPWM=25P RPWM=24P
U_Motor Drivers2: designators end in _U_Motor_Drivers2; ports ENL=9P ENR=8P LPWM=LPWM RPWM=26P

### Notes on the sheet
- Title:
- Drawn By:
- Page Contents:
- Checked By:
- Subtitle:
- University Of Moratuwa
- Moratuwa
- Size:
- Date:
- File:
- Email:
- A4
- lasithnawanjaan123@gmail.com
- Lasith Haputhanthri
- Number:
- Time:
- Revision:
- Sheet
- of
- Katubedda
- 10500
- Sri Lanka

### Library data of the parts
J5 = B6B-XH-A_LF__SN_: as J1 on sheet Accelometer and Gyroscope; Datasheet Link: https://datasheet.lcsc.com/szlcsc/JST-Sales-America-B6B-XH-A-LF-SN_C144397.pdf; Height: 7mm; Arrow Part Number: B6B-XH-A(LF)(SN); Arrow Price/Stock: https://www.arrow.com/en/products/b6b-xh-a-lf-sn/jst-manufacturing?region=europe

## Sheet Cording.SchDoc: Title
size A4; Date: *******; ApprovedBy: *******; CheckedBy: Yasiru Banayake; Author: *******; CompanyName: *******; DrawnBy: Name; Engineer: *******; Organization: *******; Address1: *******; Address2: *******; Address3: *******; Address4: *******; DocumentNumber: Doc Num; Revision: *******; SheetNumber: 3; SheetTotal: 11; Subtitle: UART Interface; Project: Resturant Robot; VersionRevision: III; TotalSheet: 11; CurrentTime: *******; CurrentDate: *******; Time: *******; DocumentFullPathAndName: *******; DocumentName: *******; ModifiedDate: *******; ImagePath: *******; ProjectName: *******; Application_BuildNumber: *******
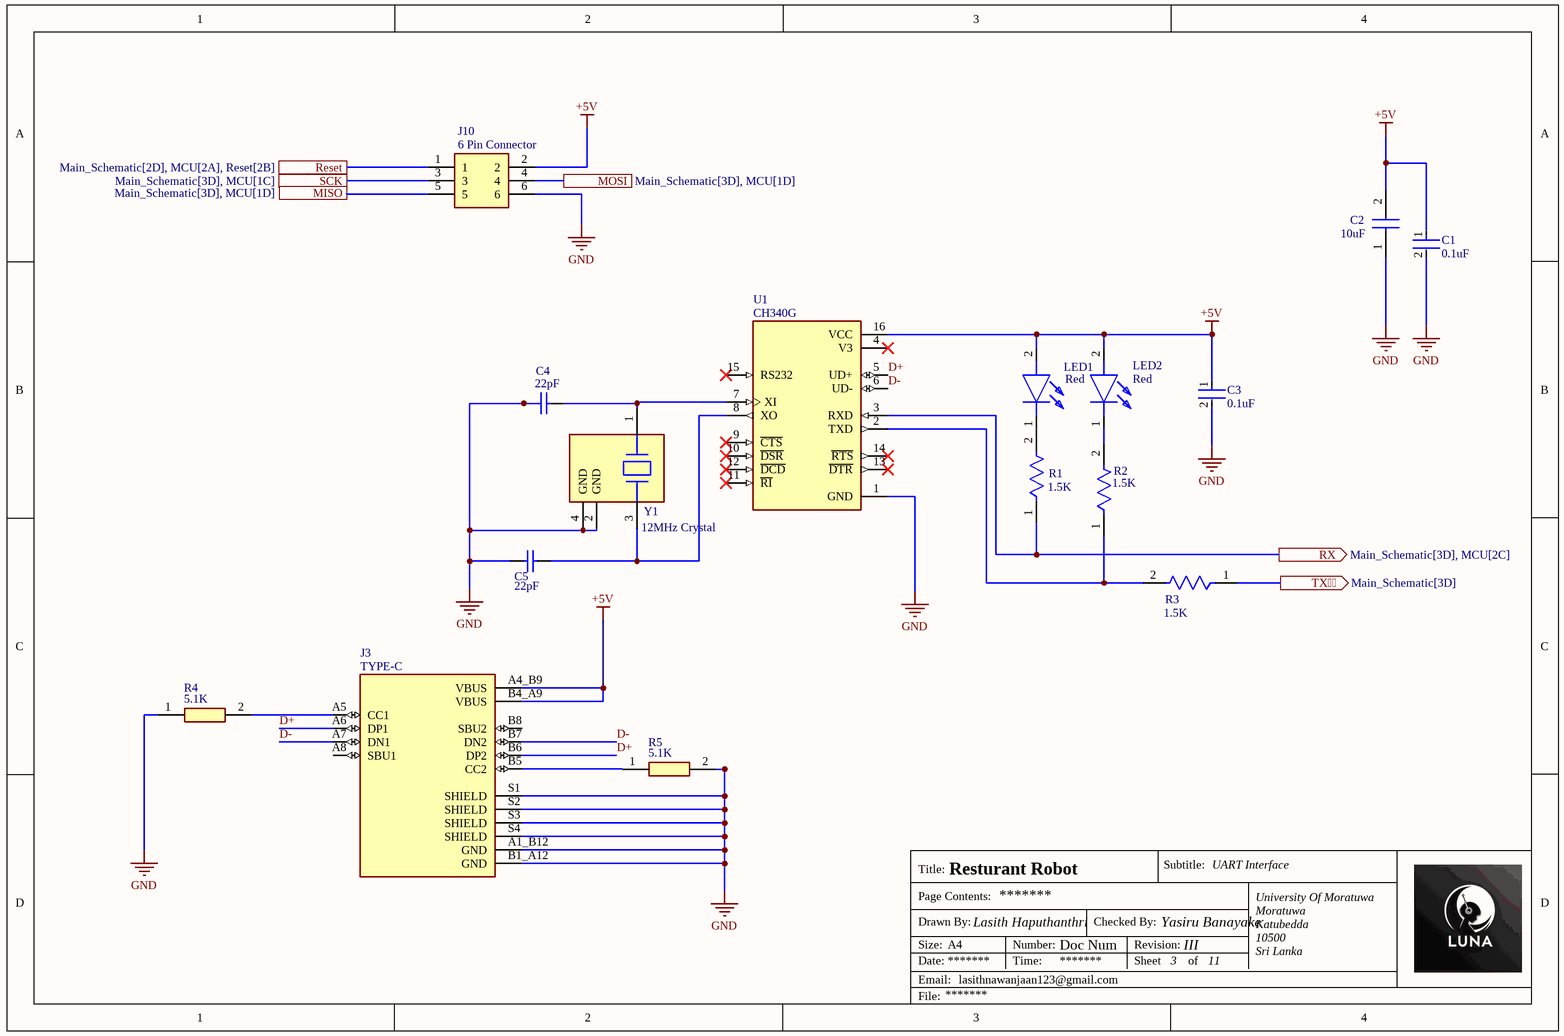
[diagram p7: Cording.SchDoc]

### Parts
C1  0.1uF  [FP-CC0603-DA-MFG]
C2  10uF  [CAPC1608X90N]
C3  0.1uF  [FP-CC0603-DA-MFG]
C4  22pF  [CAPC1608X90X40LL10T20]
C5  22pF  [CAPC1608X90X40LL10T20]
J3  TYPE-C  [HRO_TYPE-C-31-M-12]
J10  6 Pin Connector  [HDRV6W64P254_2X3_762X508X868P]
LED1  Red  [LEDC1608X55N]
LED2  Red  [LEDC1608X55N]
R1  1.5K  [FP-AF0603-IPC_B]
R2  1.5K  [FP-AF0603-IPC_B]
R3  1.5K  [FP-AF0603-IPC_B]
R4  5.1K  [RESC1608X55N]
R5  5.1K  [RESC1608X55N]
U1  CH340G  [SOIC127P600X180-16N]
Y1  12MHz Crystal  [FP-ABM8G-MFG]

### Ports
MISO (see Main_Schematic[3D], MCU[1D]), MOSI (see Main_Schematic[3D], MCU[1D]), Reset (see Main_Schematic[2D], MCU[2A], Reset[2B]), RX (out, see Main_Schematic[3D], MCU[2C]), SCK (see Main_Schematic[3D], MCU[1C]), TX (out, see Main_Schematic[3D])

### Nets
+5V: C1.1 C2.2 C3.1 J3.A4_B9(VBUS) J3.B4_A9(VBUS) J10.2 LED1.2(A) LED2.2(A) U1.16(VCC)
GND: C1.2 C2.1 C3.2 C4.1 C5.1 J3.A1_B12(GND) J3.B1_A12(GND) J3.S1(SHIELD) J3.S2(SHIELD) J3.S3(SHIELD) J3.S4(SHIELD) J10.6 R4.1 R5.2 U1.1(GND) Y1.2(GND) Y1.4(GND)
0P: R3.1 ; port TX
1P: R1.1 U1.3(RXD) ; port RX
50P: J10.5 ; port MISO
51P: J10.4 ; port MOSI
52P: J10.3 ; port SCK
D+: J3.A6(DP1) J3.B6(DP2) U1.5(UD+)
D-: J3.A7(DN1) J3.B7(DN2) U1.6(UD-)
Reset: J10.1 ; port Reset
NetC4_2: C4.2 U1.7(XI) Y1.1
NetC5_2: C5.2 U1.8(XO) Y1.3
NetJ3_A5: J3.A5(CC1) R4.2
NetJ3_B5: J3.B5(CC2) R5.1
NetLED1_1: LED1.1(K) R1.2
NetLED2_1: LED2.1(K) R2.2
NetR2_1: R2.1 R3.2 U1.2(TXD)

Not connected (* = marked no-connect by the designer): J3 A8(SBU1) B8(SBU2); U1 4(V3)* 9(~{CTS})* 10(~{DSR})* 11(~{RI})* 12(~{DCD})* 13(~{DTR})* 14(~{RTS})* 15(RS232)*

### Notes on the sheet
- Title:
- Drawn By:
- Page Contents:
- Checked By:
- Subtitle:
- University Of Moratuwa
- Moratuwa
- Size:
- Date:
- File:
- Email:
- A4
- lasithnawanjaan123@gmail.com
- Lasith Haputhanthri
- Number:
- Time:
- Revision:
- Sheet
- of
- Katubedda
- 10500
- Sri Lanka

### Library data of the parts
C1 C3 = CMP-2100-03601-2: as C15 on sheet MCU; Height: 0.9mm; Voltage: 50 V; ComponentLink2Description: Datasheet; Device Class L2: Capacitors; Temperature Range High: +125°C; Category: Cap; Footprint Url: http://www.yageo.com/exep/pages/download/literatures/UPY-C_GEN_24.pdf; ComponentLink2URL: http://www.yageo.com/documents/recent/UPY-GPHC_X7R_6.3V-to-50V_18.pdf; Package: CC0603-DA; Temperature: -55°C to +125°C; Voltage Rating: 50 V; Temperature Characteristic: X7R; Device Class L1: Passive Components; Temperature Range Low: -55°C; Manufacturer Part Number: CC0603KRX7R9BB104; RoHS: TRUE; Automotive: No; Device Class L3: Ceramic Capacitors; Octopart: https://octopart.com/cc0603krx7r9bb104-yageo-42244635; Mouser Description: Multilayer Ceramic Capacitor, CC Series, 0.1 - F, - 10%, X7R, 50 V, 0603 [1608 Metric]; Lead Free: Yes; Digikey Description: CAP CER 0.1UF 50V X7R 0603
C2 = CL10A106KP8NNNC: as C14 on sheet MCU; Datasheet Link: https://datasheet.datasheetarchive.com/originals/distributors/Datasheets-DGA10/2415998.pdf; Height: 0.9mm; Manufacturer_Part_Number: CL10A106KP8NNNC; Mouser Part Number: 187-CL10A106KP8NNNC; Mouser Price/Stock: https://www.mouser.co.uk/ProductDetail/Samsung-Electro-Mechanics/CL10A106KP8NNNC?qs=X6jEic%2FHinAlyfRHj7fKwg%3D%3D; Arrow Part Number: CL10A106KP8NNNC; Arrow Price/Stock: https://www.arrow.com/en/products/cl10a106kp8nnnc/samsung-electro-mechanics?region=europe
C4 C5 = CMP-1659-00026-1: as C12 on sheet MCU; ComponentLink1URL: http://www.yageo.com/; PackageReference: 0603; ComponentLink1Description: Manufacturer URL; PackageDescription: 2-Pin Surface Mount Device, Body 1.6 x 0.8 mm; DatasheetVersion: Rev. 8, 08/2011; ComponentLink2Description: Datasheet; ComponentLink2URL: http://www.yageo.com/documents/recent/UPY-GP_NP0_16V-to-50V_8.pdf
J3 = TYPE-C-31-M-12: TYPE-C-31-M-12 USB Connectors 24 Receptacle 1 8.94*7.3mm RoHS; MF: HRO Electronics Co., Ltd.; Price: None; Value: *; SnapEDA_Link: https://www.snapeda.com/parts/TYPE-C-31-M-12/HRO+Electronics+Co.%252C+Ltd./view-part/?ref=snap; Package: Package; Availability: Not in stock; Check_prices: https://www.snapeda.com/parts/TYPE-C-31-M-12/HRO+Electronics+Co.%252C+Ltd./view-part/?ref=eda; MP: TYPE-C-31-M-12
J10 = M20-9980346: Connector; Manufacturer_Name: Harwin; Datasheet Link: https://cdn.harwin.com/pdfs/M20-998.pdf; Height: 8.68mm; Manufacturer_Part_Number: M20-9980346; Mouser Part Number: 855-M20-9980346; Mouser Price/Stock: https://www.mouser.co.uk/ProductDetail/Harwin/M20-9980346?qs=%252Bk6%2F5FB6qrmHk2P20oz3FA%3D%3D
LED1 LED2 = LTST-C191KRKT: LED; Manufacturer_Name: Lite-On; Datasheet Link: http://www.mouser.com/ds/2/239/S_110_LTST-C191KRKT-539838.pdf; Height: 0.55mm; Manufacturer_Part_Number: LTST-C191KRKT; Mouser Part Number: 859-LTST-C191KRKT; Mouser Price/Stock: https://www.mouser.co.uk/ProductDetail/Lite-On/LTST-C191KRKT?qs=BAIUz4Y8PJBLfOhzue0q%252BA%3D%3D; Arrow Part Number: LTST-C191KRKT; Arrow Price/Stock: https://www.arrow.com/en/products/ltst-c191krkt/lite-on-technology?region=nac
R1-R3 = CMP-03412-043191-1: as R7 on sheet MCU; Length: 0.063inch; Packaging: Tape and Reel; Tolerance: 1%; RoHS Compliant: Yes; Series: AF; Temperature Coefficient: 100ppm/°C; Case/Package: 0603; Height: 0.022inch; Min Operating Temperature: -55°C; Resistor Type: Thick Film; Features: Moisture Resistant; Width: 0.031inch; Number of Terminations: 2; Max Operating Temperature: 155°C
R4 = 0603WAF5101T5E: Manufacturer_Name: UNI-ROYAL(Uniroyal Elec); Datasheet Link: https://datasheet.lcsc.com/szlcsc/Uniroyal-Elec-0603WAF5101T5E_C23186.pdf; Height: 0.55mm; Manufacturer_Part_Number: 0603WAF5101T5E
R5 = 0603WAF5101T5E: 0603WAF5101T5E Resistor; Manufacturer_Name: UNI-ROYAL(Uniroyal Elec); Datasheet Link: https://datasheet.lcsc.com/szlcsc/Uniroyal-Elec-0603WAF5101T5E_C23186.pdf; Height: 0.55mm; Manufacturer_Part_Number: 0603WAF5101T5E
U1 = CH340G: USB Interface Integrated Circuit; MF: WCH; Value: *; SnapEDA_Link: https://www.snapeda.com/parts/Ch340G/WCH/view-part/?ref=snap; MP: Ch340G; Check_prices: https://www.snapeda.com/parts/Ch340G/WCH/view-part/?ref=eda; Availability: Not in stock; Price: None; Package: None
Y1 = CMP-2000-05039-3: ABM8G-12.000MHZ-18-D2Y-T Crystal 12MHz ±20ppm (Tol) ±30ppm (Stability) 18pF FUND 120Ω 4-Pin SMD T/R; Series Resistance: 120R; Max Operating Temperature: 85°C; Mount: Surface Mount; Width: 2.5mm; Series: ABM8G; Termination: SMD/SMT; Frequency Tolerance: 20ppm; Tolerance: 20ppm; Min Operating Temperature: -40°C; Operating Frequency: 12 MHz; Depth: 2.5mm; Load Capacitance: 18pF; Number of Pins: 4; Length: 3.2mm; Radiation Hardening: No; Frequency Stability: 30ppm; Height: 1mm; Packaging: Tape and Reel; Package Quantity: 1000; ESR (Equivalent Series Resistance): 120R; Lead Free: Lead Free; Frequency: 12MHz; Case/Package: CSMD

## Sheet Sonar Sensor.SchDoc: Title
size A4; Date: *******; ApprovedBy: *******; CheckedBy: Yasiru Banayake; Author: *******; CompanyName: *******; DrawnBy: Name; Engineer: *******; Organization: *******; Address1: *******; Address2: *******; Address3: *******; Address4: *******; DocumentNumber: Doc Num; Revision: *******; SheetNumber: 8; SheetTotal: 11; Subtitle: Sonar Sensor JST; Project: Resturant Robot; VersionRevision: III; TotalSheet: 11; CurrentTime: *******; CurrentDate: *******; Time: *******; DocumentFullPathAndName: *******; DocumentName: *******; ModifiedDate: *******; ImagePath: *******; ProjectName: *******; Application_BuildNumber: *******
Used 3 times, as channels U_Sonar Sensor1, U_Sonar Sensor2, U_Sonar Sensor3. Parts and nets are listed once, with the designators drawn on the sheet.
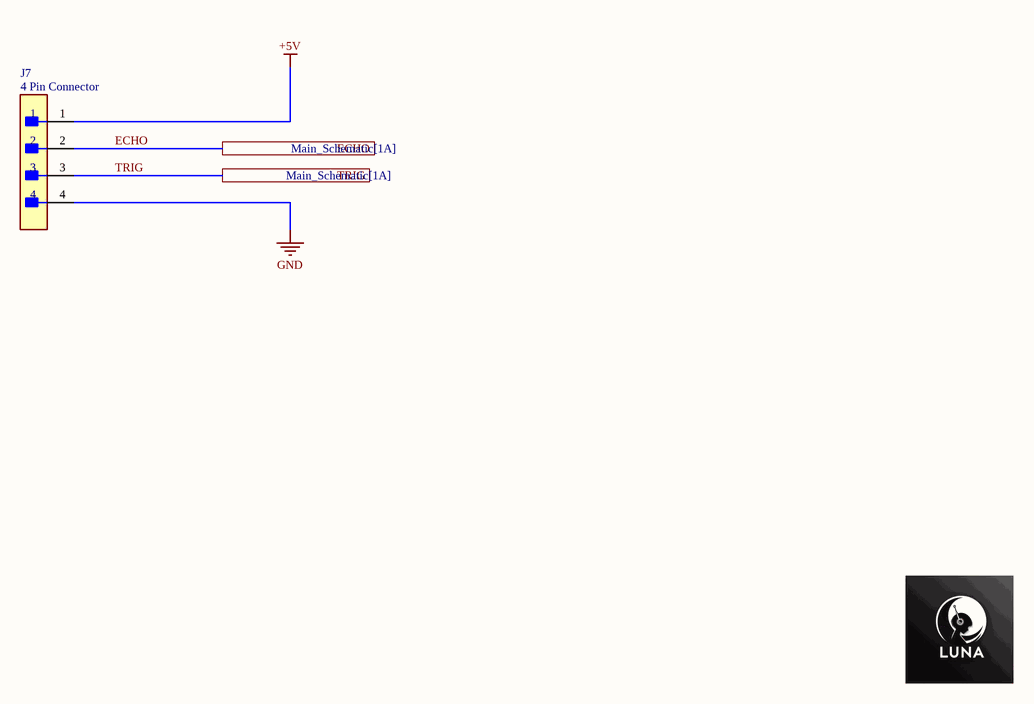
[diagram p8: Sonar Sensor.SchDoc]

### Parts
J7  4 Pin Connector  [FP-B4B-XH-A_LF_SN-MFG]

### Ports
ECHO (see Main_Schematic[1A]), TRIG (see Main_Schematic[1A])

### Nets
+5V: J7.1
GND: J7.4
ECHO: J7.2 ; port ECHO
TRIG: J7.3 ; port TRIG

### Channels
U_Sonar Sensor1: designators end in _U_Sonar_Sensor1; ports ECHO=A0 TRIG=A1
U_Sonar Sensor2: designators end in _U_Sonar_Sensor2; ports ECHO=A2 TRIG=A3
U_Sonar Sensor3: designators end in _U_Sonar_Sensor3; ports ECHO=A4 TRIG=A5

### Notes on the sheet
- Title:
- Drawn By:
- Page Contents:
- Checked By:
- Subtitle:
- University Of Moratuwa
- Moratuwa
- Size:
- Date:
- File:
- Email:
- A4
- lasithnawanjaan123@gmail.com
- Lasith Haputhanthri
- Number:
- Time:
- Revision:
- Sheet
- of
- Katubedda
- 10500
- Sri Lanka

### Library data of the parts
J7 = CMP-17439-000250-1: as J4 on sheet Encoders; Orientation: Straight; Contact Type: Male Pin; Contact Finish - Mating: TIN; Series: XH; Max Voltage Rating (AC): 250V; Lead Pitch: 2.5mm; Contact Shape: Square; Insulation Color: Natural; Termination: Solder; Lead Free: Lead Free; Voltage Rating (AC): 250V; Number of Rows: 1; Flammability Rating: UL94 V-0; Number of Positions: 4; Max Operating Temperature: 85°C; Package Quantity: 500; Mount: Through Hole; REACH SVHC: No SVHC; Connector Type: Header; Insulation Material: Nylon; Fastening Type: Detent; Min Operating Temperature: -25°C; Housing Color: White; Packaging: Bulk; Contact Plating: Tin; Contact Material: Brass; Max Voltage Rating (DC): 250V; Housing Material: Polyamide; Color: Natural; Material: Polyamide; Pitch: 2.5mm; Depth: 5.75mm; Current Rating: 3A; Length: 12.4mm

## Sheet PowerMCU.SchDoc: Title
size A4; Date: *******; ApprovedBy: *******; CheckedBy: Yasiru Banayake; Author: *******; CompanyName: *******; DrawnBy: Name; Engineer: *******; Organization: *******; Address1: *******; Address2: *******; Address3: *******; Address4: *******; DocumentNumber: Doc Num; Revision: *******; SheetNumber: 6; SheetTotal: 11; Subtitle: Power Supply for MCU; Project: Resturant Robot; VersionRevision: III; TotalSheet: 11; CurrentTime: *******; CurrentDate: *******; Time: *******; DocumentFullPathAndName: *******; DocumentName: *******; ModifiedDate: *******; ImagePath: *******; ProjectName: *******; Application_BuildNumber: *******
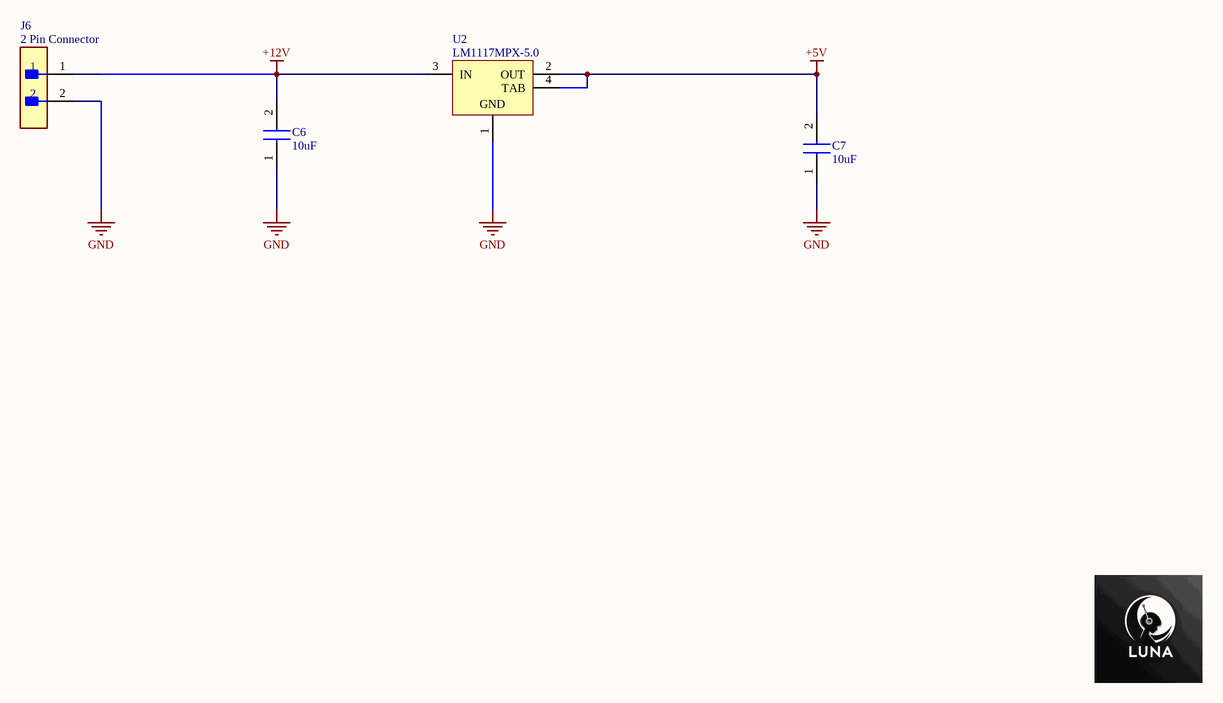
[diagram p9: PowerMCU.SchDoc]

### Parts
C6  10uF  [CAPC1608X90N]
C7  10uF  [CAPC1608X90N]
J6  2 Pin Connector  [FP-B2B-XH-AM_LF_SN-MFG]
U2  LM1117MPX-5.0  [DCY0004A_L]

### Nets
+5V: C7.2 U2.2(OUT) U2.4(TAB)
+12V: C6.2 J6.1 U2.3(IN)
GND: C6.1 C7.1 J6.2 U2.1(GND)

### Notes on the sheet
- Title:
- Drawn By:
- Page Contents:
- Checked By:
- Subtitle:
- University Of Moratuwa
- Moratuwa
- Size:
- Date:
- File:
- Email:
- A4
- lasithnawanjaan123@gmail.com
- Lasith Haputhanthri
- Number:
- Time:
- Revision:
- Sheet
- of
- Katubedda
- 10500
- Sri Lanka

### Library data of the parts
C6 C7 = CL10A106KP8NNNC: as C14 on sheet MCU; Datasheet Link: https://datasheet.datasheetarchive.com/originals/distributors/Datasheets-DGA10/2415998.pdf; Height: 0.9mm; Manufacturer_Part_Number: CL10A106KP8NNNC; Mouser Part Number: 187-CL10A106KP8NNNC; Mouser Price/Stock: https://www.mouser.co.uk/ProductDetail/Samsung-Electro-Mechanics/CL10A106KP8NNNC?qs=X6jEic%2FHinAlyfRHj7fKwg%3D%3D; Arrow Part Number: CL10A106KP8NNNC; Arrow Price/Stock: https://www.arrow.com/en/products/cl10a106kp8nnnc/samsung-electro-mechanics?region=europe
J6 = CMP-17439-000037-1: CONN HEADER VERT 2POS 2.5MM; Max Voltage Rating (AC): 250V; Connector Type: Male Pin; Contact Resistance: 20mR; Max Current Rating: 3A; Number of Positions: 2; Series: XH; Contact Material: Brass; Mount: Through Hole; Housing Material: Polyamide; Contact Plating: Tin; Termination: Solder; Max Operating Temperature: 85°C; Depth: 5.75mm; Packaging: Bulk; Min Operating Temperature: -25°C; Contact Type: Male Pin; Color: Green; Pitch: 2.5mm; Length: 7.4mm; Lead Free: Lead Free; Number of Rows: 1; Fastening Type: Detent; Housing Color: White; Orientation: Straight
U2 = CMP-0062-01637-4: 800mA Low-Dropout Linear Regulator, 4-pin SOT-223; Manufacturer: Texas Instruments; High-Reliability: Y; PowerWise: N; PackageTopMarking: XYTT*N06A; CompType: LDO IC; PackageDescription: Molded SOT-223, 6.50 x 3.56 x 1.6mm Body, 4 Lead, 2.3mm Pitch; PackageReference: DCY0004A; ComponentLink1URL: http://www.ti.com/general/docs/lit/getliterature.tsp?genericPartNumber=LM1117-N&fileType=pdf; Code_JEDEC: TO-261-AA; ComponentLink1Description: Datasheet URL; PartNumber: LM1117MPX-5.0; Code_IPC: SOT223-4; RoHS: N; PinCount: 4

## Sheet Power_Supply_Motor.SchDoc: Title
size A4; Date: *******; ApprovedBy: *******; CheckedBy: Yasiru Banayake; Author: *******; CompanyName: *******; DrawnBy: Name; Engineer: *******; Organization: *******; Address1: *******; Address2: *******; Address3: *******; Address4: *******; DocumentNumber: Doc Num; Revision: *******; SheetNumber: 7; SheetTotal: 11; Subtitle: Power Supply; Sensors and Drivers; Project: Resturant Robot; VersionRevision: III; TotalSheet: 11; CurrentTime: *******; CurrentDate: *******; Time: *******; DocumentFullPathAndName: *******; DocumentName: *******; ModifiedDate: *******; ImagePath: *******; ProjectName: *******; Application_BuildNumber: *******
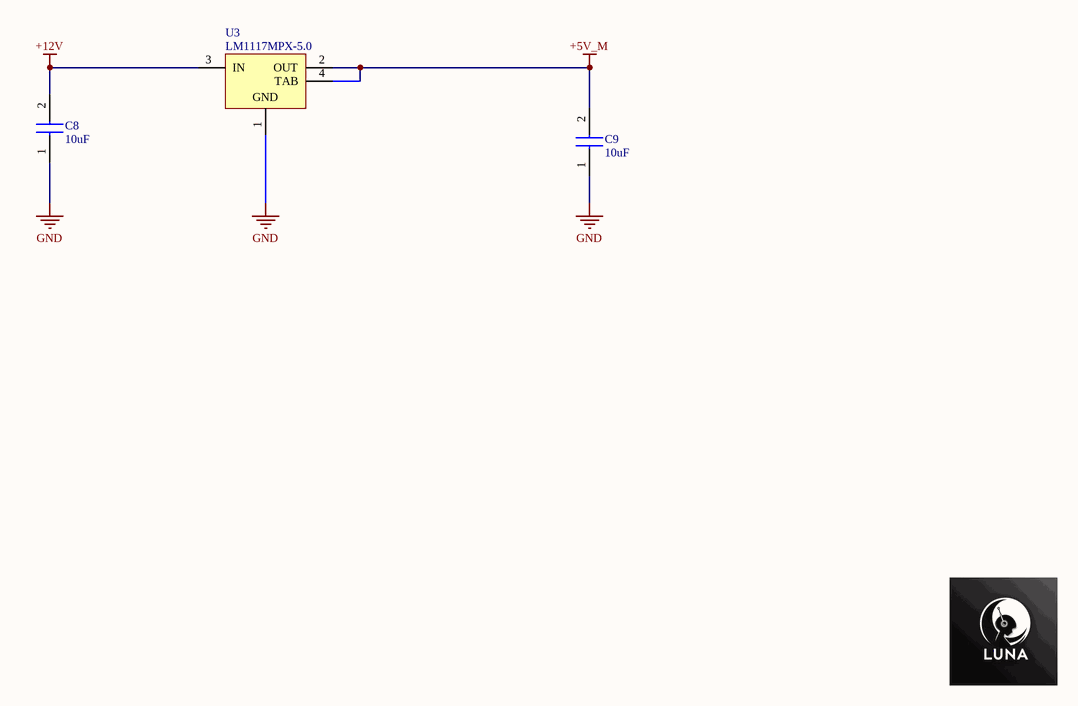
[diagram p10: Power_Supply_Motor.SchDoc]

### Parts
C8  10uF  [CAPC1608X90N]
C9  10uF  [CAPC1608X90N]
U3  LM1117MPX-5.0  [DCY0004A_L]

### Nets
+5V_M: C9.2 U3.2(OUT) U3.4(TAB)
+12V: C8.2 U3.3(IN)
GND: C8.1 C9.1 U3.1(GND)

### Notes on the sheet
- Title:
- Drawn By:
- Page Contents:
- Checked By:
- Subtitle:
- University Of Moratuwa
- Moratuwa
- Size:
- Date:
- File:
- Email:
- A4
- lasithnawanjaan123@gmail.com
- Lasith Haputhanthri
- Number:
- Time:
- Revision:
- Sheet
- of
- Katubedda
- 10500
- Sri Lanka

### Library data of the parts
C8 C9 = CL10A106KP8NNNC: as C14 on sheet MCU; Datasheet Link: https://datasheet.datasheetarchive.com/originals/distributors/Datasheets-DGA10/2415998.pdf; Height: 0.9mm; Manufacturer_Part_Number: CL10A106KP8NNNC; Mouser Part Number: 187-CL10A106KP8NNNC; Mouser Price/Stock: https://www.mouser.co.uk/ProductDetail/Samsung-Electro-Mechanics/CL10A106KP8NNNC?qs=X6jEic%2FHinAlyfRHj7fKwg%3D%3D; Arrow Part Number: CL10A106KP8NNNC; Arrow Price/Stock: https://www.arrow.com/en/products/cl10a106kp8nnnc/samsung-electro-mechanics?region=europe
U3 = CMP-0062-01637-4: as U2 on sheet PowerMCU; PackageDescription: Molded SOT-223, 6.50 x 3.56 x 1.6mm Body, 4 Lead, 2.3mm Pitch; PackageReference: DCY0004A; ComponentLink1URL: http://www.ti.com/general/docs/lit/getliterature.tsp?genericPartNumber=LM1117-N&fileType=pdf; Code_JEDEC: TO-261-AA; ComponentLink1Description: Datasheet URL; PartNumber: LM1117MPX-5.0; Code_IPC: SOT223-4; RoHS: N; PinCount: 4

## Nets that join several sheets
+5V: MCU (11 pins), Reset (R6.2), U_Accelometer and Gyroscope (J1_U_Accelometer_and_Gyroscope#1.1), U_Accelometer and Gyroscope (J1_U_Accelometer_and_Gyroscope#2.1), U_Encoders (J4_U_Encoders#1.1), U_Encoders (J4_U_Encoders#2.1), Cording (9 pins), U_Sonar Sensor1 (J7_U_Sonar_Sensor1.1), U_Sonar Sensor2 (J7_U_Sonar_Sensor2.1), U_Sonar Sensor3 (J7_U_Sonar_Sensor3.1), PowerMCU (C7.2 U2.2 U2.4)
+5V_M: U_Steppers1 (J8_U_Steppers1.1), U_Steppers2 (J8_U_Steppers2.1), U_Motor Drivers1 (J5_U_Motor_Drivers1.1), U_Motor Drivers2 (J5_U_Motor_Drivers2.1), Power_Supply_Motor (C9.2 U3.2 U3.4)
+12V: PowerMCU (C6.2 J6.1 U2.3), Power_Supply_Motor (C8.2 U3.3)
GND: MCU (19 pins), Reset (C10.1 SW1.1 SW1.2), U_Accelometer and Gyroscope (J1_U_Accelometer_and_Gyroscope#1.2), U_Accelometer and Gyroscope (J1_U_Accelometer_and_Gyroscope#2.2), U_Encoders (J4_U_Encoders#1.4), U_Steppers1 (J8_U_Steppers1.6), U_Steppers2 (J8_U_Steppers2.6), U_Motor Drivers1 (J5_U_Motor_Drivers1.2), U_Motor Drivers2 (J5_U_Motor_Drivers2.2), U_Encoders (J4_U_Encoders#2.4), Cording (17 pins), U_Sonar Sensor1 (J7_U_Sonar_Sensor1.4), U_Sonar Sensor2 (J7_U_Sonar_Sensor2.4), U_Sonar Sensor3 (J7_U_Sonar_Sensor3.4), PowerMCU (C6.1 C7.1 J6.2 U2.1), Power_Supply_Motor (C8.1 C9.1 U3.1)
0P: MCU (U4.2), Cording (R3.1)
1P: MCU (U4.3), Cording (R1.1 U1.3)
2P: MCU (U4.6), U_Encoders (J4_U_Encoders#1.2)
3P: MCU (U4.7), U_Encoders (J4_U_Encoders#1.3)
4P: MCU (U4.1), U_Steppers2 (J8_U_Steppers2.5)
6P: MCU (U4.15), U_Motor Drivers1 (J5_U_Motor_Drivers1.5)
7P: MCU (U4.16), U_Motor Drivers1 (J5_U_Motor_Drivers1.6)
8P: MCU (U4.17), U_Motor Drivers2 (J5_U_Motor_Drivers2.5)
9P: MCU (U4.18), U_Motor Drivers2 (J5_U_Motor_Drivers2.6)
10P: MCU (U4.23), U_Steppers1 (J8_U_Steppers1.2)
11P: MCU (U4.24), U_Steppers1 (J8_U_Steppers1.3)
12P: MCU (U4.25), U_Steppers1 (J8_U_Steppers1.4)
13P: MCU (LED3.2 U4.26), U_Steppers1 (J8_U_Steppers1.5)
18P: MCU (U4.46), U_Encoders (J4_U_Encoders#2.3)
19P: MCU (U4.45), U_Encoders (J4_U_Encoders#2.2)
20P: MCU (R10.2 U4.44), U_Accelometer and Gyroscope (J1_U_Accelometer_and_Gyroscope#1.4), U_Accelometer and Gyroscope (J1_U_Accelometer_and_Gyroscope#2.4)
21P: MCU (R9.2 U4.43), U_Accelometer and Gyroscope (J1_U_Accelometer_and_Gyroscope#1.3), U_Accelometer and Gyroscope (J1_U_Accelometer_and_Gyroscope#2.3)
22P: MCU (U4.78), U_Accelometer and Gyroscope (J1_U_Accelometer_and_Gyroscope#1.5)
23P: MCU (U4.77), U_Accelometer and Gyroscope (J1_U_Accelometer_and_Gyroscope#2.5)
24P: MCU (U4.76), U_Motor Drivers1 (J5_U_Motor_Drivers1.3)
25P: MCU (U4.75), U_Motor Drivers1 (J5_U_Motor_Drivers1.4)
26P: MCU (U4.74), U_Motor Drivers2 (J5_U_Motor_Drivers2.3)
44P: MCU (U4.40), U_Steppers2 (J8_U_Steppers2.4)
45P: MCU (U4.39), U_Steppers2 (J8_U_Steppers2.3)
46P: MCU (U4.38), U_Steppers2 (J8_U_Steppers2.2)
50P: MCU (U4.22), Cording (J10.5)
51P: MCU (U4.21), Cording (J10.4)
52P: MCU (U4.20), Cording (J10.3)
A0: MCU (U4.97), U_Sonar Sensor1 (J7_U_Sonar_Sensor1.2)
A1: MCU (U4.96), U_Sonar Sensor1 (J7_U_Sonar_Sensor1.3)
A2: MCU (U4.95), U_Sonar Sensor2 (J7_U_Sonar_Sensor2.2)
A3: MCU (U4.94), U_Sonar Sensor2 (J7_U_Sonar_Sensor2.3)
A4: MCU (U4.93), U_Sonar Sensor3 (J7_U_Sonar_Sensor3.2)
A5: MCU (U4.92), U_Sonar Sensor3 (J7_U_Sonar_Sensor3.3)
LPWM: MCU (U4.73), U_Motor Drivers2 (J5_U_Motor_Drivers2.4)
Reset: MCU (U4.30), Reset (C10.2 R6.1 SW1.3 SW1.4), Cording (J10.1)